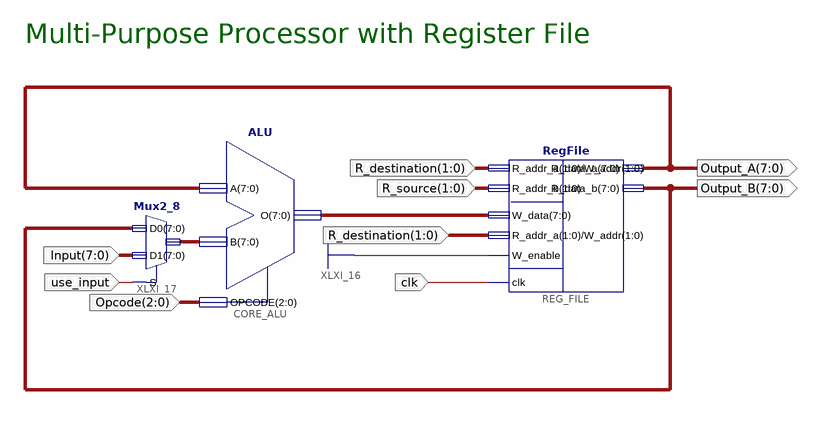
[diagram p0: schematic sheet 1]
// Xilinx ISE schematic MPP_RegFile.sch (spartan3e) as structural Verilog: 3 symbols, 8 ports
module MPP_RegFile (
  input  [1:0] R_destination,
  input  clk,
  input  [2:0] Opcode,
  input  [7:0] Input,
  input  use_input,
  input  [1:0] R_source,
  output [7:0] Output_B,
  output [7:0] Output_A
);

  wire [7:0] XLXN_52, XLXN_73;

  ALU CORE_ALU (.A(Output_A), .B(XLXN_73), .O(XLXN_52), .OPCODE(Opcode));
  RegFile REG_FILE (
    .R_addr_b(R_source), .R_addr_a(R_destination), .clk(clk), .W_data(XLXN_52), .W_addr(R_destination),
    .W_enable(1'b1), .R_data_a(Output_A), .R_data_b(Output_B));
  Mux2_8 XLXI_17 (.O(XLXN_73), .D0(Output_B), .D1(Input), .S(use_input));

  // Notes on the sheet:
  //   Multi-Purpose Processor with Register File
endmodule
